# EAGLE design SOLDERING STATION (EAGLE 8.3.0)
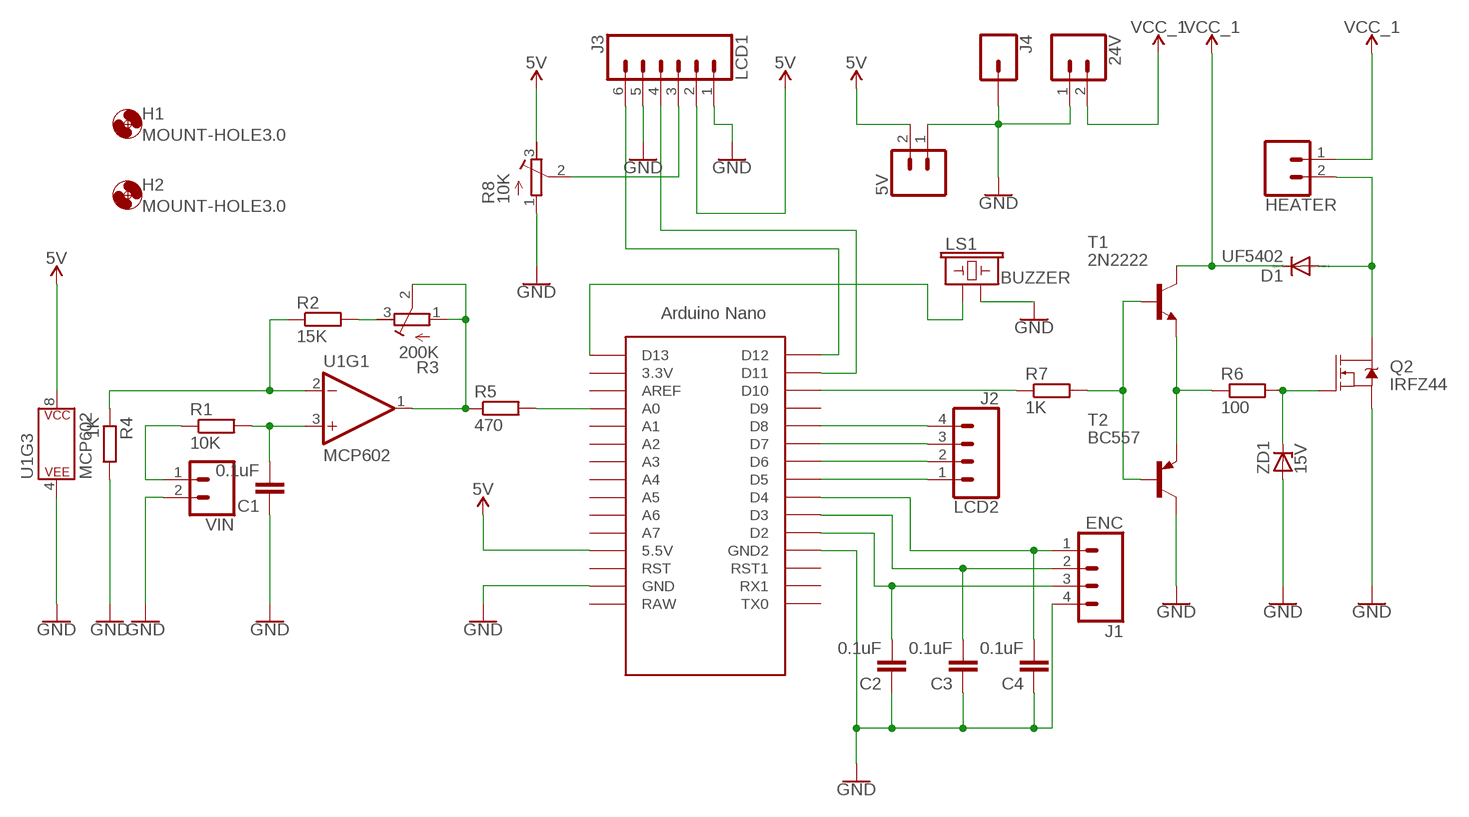
[diagram p0: schematic, sheet 1]

## Parts
5V  CONN_025MM  [SCREWTERMINAL-5MM-2]
24V  CONN_025MM  [SCREWTERMINAL-5MM-2]
C1  0.1uF  C-EU025-024X044  [C025-024X044]
C2  0.1uF  C-EU025-024X044  [C025-024X044]
C3  0.1uF  C-EU025-024X044  [C025-024X044]
C4  0.1uF  C-EU025-024X044  [C025-024X044]
D1  UF5402  UF4003  [DO41-10]
H1  MOUNT-HOLE3.0  [3,0]
H2  MOUNT-HOLE3.0  [3,0]
HEATER  CONN_02PTH4  [1X02_XTRA_BIG]
J1  ENC  CONN_04LONGPADS  [1X04_LONGPADS]
J2  LCD2  CONN_04LONGPADS  [1X04_LONGPADS]
J3  LCD1  CONN_06LONGPADS  [1X06_LONGPADS]
J4  CONN_01PTH_2MM  [1X01_2MM]
LS1  BUZZER  BUZZER-PTH_NO_SILK  [BUZZER-12MM-NS]
Q2  IRFZ44  MOSFET-NCH-FQP30N06L  [TO220V]
R1  10K  R-EU_0204/7  [0204/7]
R2  15K  R-EU_0204/7  [0204/7]
R3  200K  R-TRIMM64W  [RTRIM64W]
R4  1K  R-EU_0204/7  [0204/7]
R5  470  R-EU_0204/7  [0204/7]
R6  100  R-EU_0204/7  [0204/7]
R7  1K  R-EU_0204/7  [0204/7]
R8  10K  R-TRIMM64W  [RTRIM64W]
T1  2N2222  [TO92-EBC-OVAL]
T2  BC557  [TO92]
U1  MCP602  LM358  [DIP08]
U$1  NANO  [NANO]
VIN  CONN_02POLAR_LOCK  [MOLEX-1X2_LOCK]
ZD1  15V  1N4728  [DO41Z10]

## Nets
5V: 5V.2 J3.2 R8.3(E) U1.8(P$V+) U$1.5V(5.5V)
GND: 5V.1 24V.1 C1.1 C2.1 C3.1 C4.1 J1.4 J3.1 J3.5 J4.1 LS1.- Q2.3(S) R4.2 R8.1(A) T2.3(C) U1.4(P$V-) U$1.GND U$1.GND1(GND2) VIN.2 ZD1.A
N$1: C1.2 R1.2 U1.3(+IN)
N$2: R2.1 R4.1 U1.2(-IN)
N$3: R1.1 VIN.1
N$4: R2.2 R3.3(E)
N$5: R3.1(A) R3.2(S) R5.1 U1.1(OUT)
N$6: R5.2 U$1.A0
N$7: R7.1 U$1.D10
N$8: D1.A HEATER.2 Q2.2(D)
N$10: C4.2 J1.1 U$1.D4
N$11: R7.2 T1.B T2.2(B)
N$12: R6.1 T1.E T2.1(E)
N$13: Q2.1(G) R6.2 ZD1.C
N$14: C3.2 J1.2 U$1.D3
N$15: C2.2 J1.3 U$1.D2
N$16: J2.1 U$1.D5
N$17: J2.2 U$1.D6
N$18: J3.3 R8.2(S)
N$19: J2.3 U$1.D7
N$20: J2.4 U$1.D8
N$21: LS1.+ U$1.D13
N$22: J3.6 U$1.D12
N$23: J3.4 U$1.D11
VCC_1: 24V.2 D1.C HEATER.1 T1.C
Unconnected: U1.5(+IN) U1.6(-IN) U1.7(OUT) U$1.3.3V U$1.A1 U$1.A2 U$1.A3 U$1.A4 U$1.A5 U$1.A6 U$1.A7 U$1.AREF U$1.D9 U$1.ICSP1 U$1.ICSP2 U$1.ICSP3 U$1.ICSP4 U$1.ICSP5 U$1.ICSP6 U$1.RAW U$1.RST U$1.RST1 U$1.RX1 U$1.TX0

## Library data of the parts
5V 24V = SparkFun-Connectors:CONN_02: Multi connection point. Often used as Generic Header-pin footprint for 0.1 inch spaced/style header connections On any of the 0.1 inch spaced packages, you can populate with these: Break Away Headers - Straight <https://www.sparkfun.com/products/116> (PRT-00116) Break Away Male Headers - Right Angle <https://www.sparkfun.com/products/553> (PRT-00553) Female Headers <https://www.sparkfun.com/products/115> (PRT-00115) Break Away Headers - Machine Pin <https://www.sparkfun.com/products/117> (PRT-00117) Break Away Female Headers - Swiss Machine Pin <https://www.sparkfun.com/products/743> (PRT-00743) For SCREWTERMINALS and SPRING TERMINALS visit here: Screw Terimnals on SparkFun.com <https://www.sparkfun.com/search/results?term=Screw+Terminals> (5mm/3.5mm/2.54mm spacing) This device is also useful as a general connection point to wire up your design to another part of your project. Our various solder wires solder well into these plated through hole pads. Hook-Up Wire - Assortment (Stranded, 22 AWG) <https://www.sparkfun.com/products/11375> (PRT-11375) Hook-Up Wire - Assortment (Solid Core, 22 AWG) <https://www.sparkfun.com/products/11367> (PRT-11367) View the entire wire category on our website here <https://www.sparkfun.com/categories/141> Special notes: Molex polarized connector foot print use with: PRT-08233 with associated crimp pins and housings. 2.54_SCREWTERM for use with PRT-10571. 3.5mm Screw Terminal footprints for PRT-08084 5mm Screw Terminal footprints for use with PRT-08432; SF_SKU: PRT-08432
C1-C4 = resistor:C-EU: CAPACITOR, European symbol
D1 = diode:UF4003: DIODE ultrafast recovery diode, 200 V rectifier
H1 H2 = holes:MOUNT-HOLE: MOUNTING HOLE with drill center marker
HEATER = SparkFun-Connectors:CONN_02: Multi connection point. Often used as Generic Header-pin footprint for 0.1 inch spaced/style header connections On any of the 0.1 inch spaced packages, you can populate with these: Break Away Headers - Straight <https://www.sparkfun.com/products/116> (PRT-00116) Break Away Male Headers - Right Angle <https://www.sparkfun.com/products/553> (PRT-00553) Female Headers <https://www.sparkfun.com/products/115> (PRT-00115) Break Away Headers - Machine Pin <https://www.sparkfun.com/products/117> (PRT-00117) Break Away Female Headers - Swiss Machine Pin <https://www.sparkfun.com/products/743> (PRT-00743) For SCREWTERMINALS and SPRING TERMINALS visit here: Screw Terimnals on SparkFun.com <https://www.sparkfun.com/search/results?term=Screw+Terminals> (5mm/3.5mm/2.54mm spacing) This device is also useful as a general connection point to wire up your design to another part of your project. Our various solder wires solder well into these plated through hole pads. Hook-Up Wire - Assortment (Stranded, 22 AWG) <https://www.sparkfun.com/products/11375> (PRT-11375) Hook-Up Wire - Assortment (Solid Core, 22 AWG) <https://www.sparkfun.com/products/11367> (PRT-11367) View the entire wire category on our website here <https://www.sparkfun.com/categories/141> Special notes: Molex polarized connector foot print use with: PRT-08233 with associated crimp pins and housings. 2.54_SCREWTERM for use with PRT-10571. 3.5mm Screw Terminal footprints for PRT-08084 5mm Screw Terminal footprints for use with PRT-08432
J1 J2 = SparkFun-Connectors:CONN_04: Multi connection point. Often used as Generic Header-pin footprint for 0.1 inch spaced/style header connections On any of the 0.1 inch spaced packages, you can populate with these: Break Away Headers - Straight <https://www.sparkfun.com/products/116> (PRT-00116) Break Away Male Headers - Right Angle <https://www.sparkfun.com/products/553> (PRT-00553) Female Headers <https://www.sparkfun.com/products/115> (PRT-00115) Break Away Headers - Machine Pin <https://www.sparkfun.com/products/117> (PRT-00117) Break Away Female Headers - Swiss Machine Pin <https://www.sparkfun.com/products/743> (PRT-00743) For SCREWTERMINALS and SPRING TERMINALS visit here: Screw Terimnals on SparkFun.com <https://www.sparkfun.com/search/results?term=Screw+Terminals> (5mm/3.5mm/2.54mm spacing) This device is also useful as a general connection point to wire up your design to another part of your project. Our various solder wires solder well into these plated through hole pads. Hook-Up Wire - Assortment (Stranded, 22 AWG) <https://www.sparkfun.com/products/11375> (PRT-11375) Hook-Up Wire - Assortment (Solid Core, 22 AWG) <https://www.sparkfun.com/products/11367> (PRT-11367) View the entire wire category on our website here <https://www.sparkfun.com/categories/141> Special notes: Molex polarized connector foot print use with SKU : PRT-08231 with associated crimp pins and housings. 1MM SMD Version SKU: PRT-10208; PROD_ID: CONN-09696
J3 = SparkFun-Connectors:CONN_06: Multi connection point. Often used as Generic Header-pin footprint for 0.1 inch spaced/style header connections On any of the 0.1 inch spaced packages, you can populate with these: Break Away Headers - Straight <https://www.sparkfun.com/products/116> (PRT-00116) Break Away Male Headers - Right Angle <https://www.sparkfun.com/products/553> (PRT-00553) Female Headers <https://www.sparkfun.com/products/115> (PRT-00115) Break Away Headers - Machine Pin <https://www.sparkfun.com/products/117> (PRT-00117) Break Away Female Headers - Swiss Machine Pin <https://www.sparkfun.com/products/743> (PRT-00743) Arduino Stackable Header - 6 Pin <https://www.sparkfun.com/products/9280> (PRT-09280) For SCREWTERMINALS and SPRING TERMINALS visit here: Screw Terimnals on SparkFun.com <https://www.sparkfun.com/search/results?term=Screw+Terminals> (5mm/3.5mm/2.54mm spacing) This device is also useful as a general connection point to wire up your design to another part of your project. Our various solder wires solder well into these plated through hole pads. Hook-Up Wire - Assortment (Stranded, 22 AWG) <https://www.sparkfun.com/products/11375> (PRT-11375) Hook-Up Wire - Assortment (Solid Core, 22 AWG) <https://www.sparkfun.com/products/11367> (PRT-11367) View the entire wire category on our website here <https://www.sparkfun.com/categories/141>
J4 = SparkFun-Connectors:CONN_01: Single connection point. Often used as Generic Header-pin footprint for 0.1 inch spaced/style header connections On any of the 0.1 inch spaced packages, you can populate with these: Break Away Headers - Straight <https://www.sparkfun.com/products/116> (PRT-00116) Break Away Male Headers - Right Angle <https://www.sparkfun.com/products/553> (PRT-00553) Female Headers <https://www.sparkfun.com/products/115> (PRT-00115) Break Away Headers - Machine Pin <https://www.sparkfun.com/products/117> (PRT-00117) Break Away Female Headers - Swiss Machine Pin <https://www.sparkfun.com/products/743> (PRT-00743) This device is also useful as a general connection point to wire up your design to another part of your project. Our various solder wires solder well into these plated through hole pads. Hook-Up Wire - Assortment (Stranded, 22 AWG) <https://www.sparkfun.com/products/11375> (PRT-11375) Hook-Up Wire - Assortment (Solid Core, 22 AWG) <https://www.sparkfun.com/products/11367> (PRT-11367) View the entire wire category on our website here <https://www.sparkfun.com/categories/141> Special notes: SMTSO-256-ET is a "flush mount" nut for a 4-40 screw. We mostly use this on specialty testbeds; it is a nice way to connect hardware to your PCB at an adjustable hieght. Also note, the SNAP packages are for using a snappable style connector. We sell a baggie of snaps and they are also used on two LilyPad designs: Snap Assortment - 30 pack (male and female) <https://www.sparkfun.com/products/11347> (DEV-11347) LilyPad Arduino SimpleSnap <https://www.sparkfun.com/products/10941> (DEV-10941) LilyPad SimpleSnap Protoboard <https://www.sparkfun.com/products/10940> (DEV-10940)
LS1 = SparkFun-Electromechanical:BUZZER: Buzzer Small round buzzers that operate around the audible 2kHz range. You can use these as speakers to create simple music or user interfaces. Variant Overview: PTH - Mini Speaker - PC Mount 12mm 2.048kHz <https://www.sparkfun.com/products/7950> PTH_KIT - Mini Speaker - PC Mount 12mm 2.048kHz <https://www.sparkfun.com/products/7950> KIT simplifies soldering by adding stop mask to one side of the pads. PTH_NO_SILK - Mini Speaker - PC Mount 12mm 2.048kHz <https://www.sparkfun.com/products/7950> No silkscreen indicator of buzzer outline. PTH_KIT_NO_SILK - Mini Speaker - PC Mount 12mm 2.048kHz <https://www.sparkfun.com/products/7950> KIT package w/o silkscreen SMD - Buzzer Audio Magnetic (CCV-084B16) SMD buzzer used on, e.g. the LilyPad Buzzer <https://www.sparkfun.com/products/8463> and RFID USB Reader <https://www.sparkfun.com/products/9963>. SMD_KIT - Buzzer Audio Magnetic (CCV-084B16) SMD Buzzer with elongated pins to make soldering easier. Used on the SparkFun Simon Says - Surface Mount Soldering Kit <https://www.sparkfun.com/products/10935>.; PROD_ID: COMP-08253; SF_SKU: COM-07950
Q2 = SparkFun-DiscreteSemi:MOSFET-NCH: N-channel MOSFETs Voltage controlled devices that allow control of high current outputs. SparkFun Products: SparkFun OpenScale <https://www.sparkfun.com/products/13261> SparkFun Digital Sandbox <https://www.sparkfun.com/products/12651> SparkFun Monster Moto Shield <https://www.sparkfun.com/products/10182> SparkFun MOSFET Power Controller <https://www.sparkfun.com/products/11214>; PROD_ID: TRANS-10060; VALUE: 60V/32A/35mΩ
R1 R2 R4-R7 = resistor:R-EU_: RESISTOR, European symbol
R3 R8 = resistor:R-TRIMM: Trimm resistor
T1 = adafruit:2N2222: NPN TRANSISTOR Big oval pads
T2 = transistor-pnp:BC557: PNP Transistor
U1 = SparkFun-IC-Amplifiers:LM358: LM358 Jellybean op-amp Datasheet <http://www.sparkfun.com/datasheets/Components/General/LM358.pdf> SparkFun Products Op-Amp (Thru-Hole) - LM358 <https://www.sparkfun.com/products/9456> (COM-09456); PROD_ID: IC-09172; VALUE: LM358
U$1 = Arduino-clone:NANO: Arduino Nano
VIN = SparkFun-Connectors:CONN_02: Multi connection point. Often used as Generic Header-pin footprint for 0.1 inch spaced/style header connections On any of the 0.1 inch spaced packages, you can populate with these: Break Away Headers - Straight <https://www.sparkfun.com/products/116> (PRT-00116) Break Away Male Headers - Right Angle <https://www.sparkfun.com/products/553> (PRT-00553) Female Headers <https://www.sparkfun.com/products/115> (PRT-00115) Break Away Headers - Machine Pin <https://www.sparkfun.com/products/117> (PRT-00117) Break Away Female Headers - Swiss Machine Pin <https://www.sparkfun.com/products/743> (PRT-00743) For SCREWTERMINALS and SPRING TERMINALS visit here: Screw Terimnals on SparkFun.com <https://www.sparkfun.com/search/results?term=Screw+Terminals> (5mm/3.5mm/2.54mm spacing) This device is also useful as a general connection point to wire up your design to another part of your project. Our various solder wires solder well into these plated through hole pads. Hook-Up Wire - Assortment (Stranded, 22 AWG) <https://www.sparkfun.com/products/11375> (PRT-11375) Hook-Up Wire - Assortment (Solid Core, 22 AWG) <https://www.sparkfun.com/products/11367> (PRT-11367) View the entire wire category on our website here <https://www.sparkfun.com/categories/141> Special notes: Molex polarized connector foot print use with: PRT-08233 with associated crimp pins and housings. 2.54_SCREWTERM for use with PRT-10571. 3.5mm Screw Terminal footprints for PRT-08084 5mm Screw Terminal footprints for use with PRT-08432; SF_ID: PRT-09918
ZD1 = diode:1N4728: Z DIODE 3.3 V, 1W, 5 percent

## Board
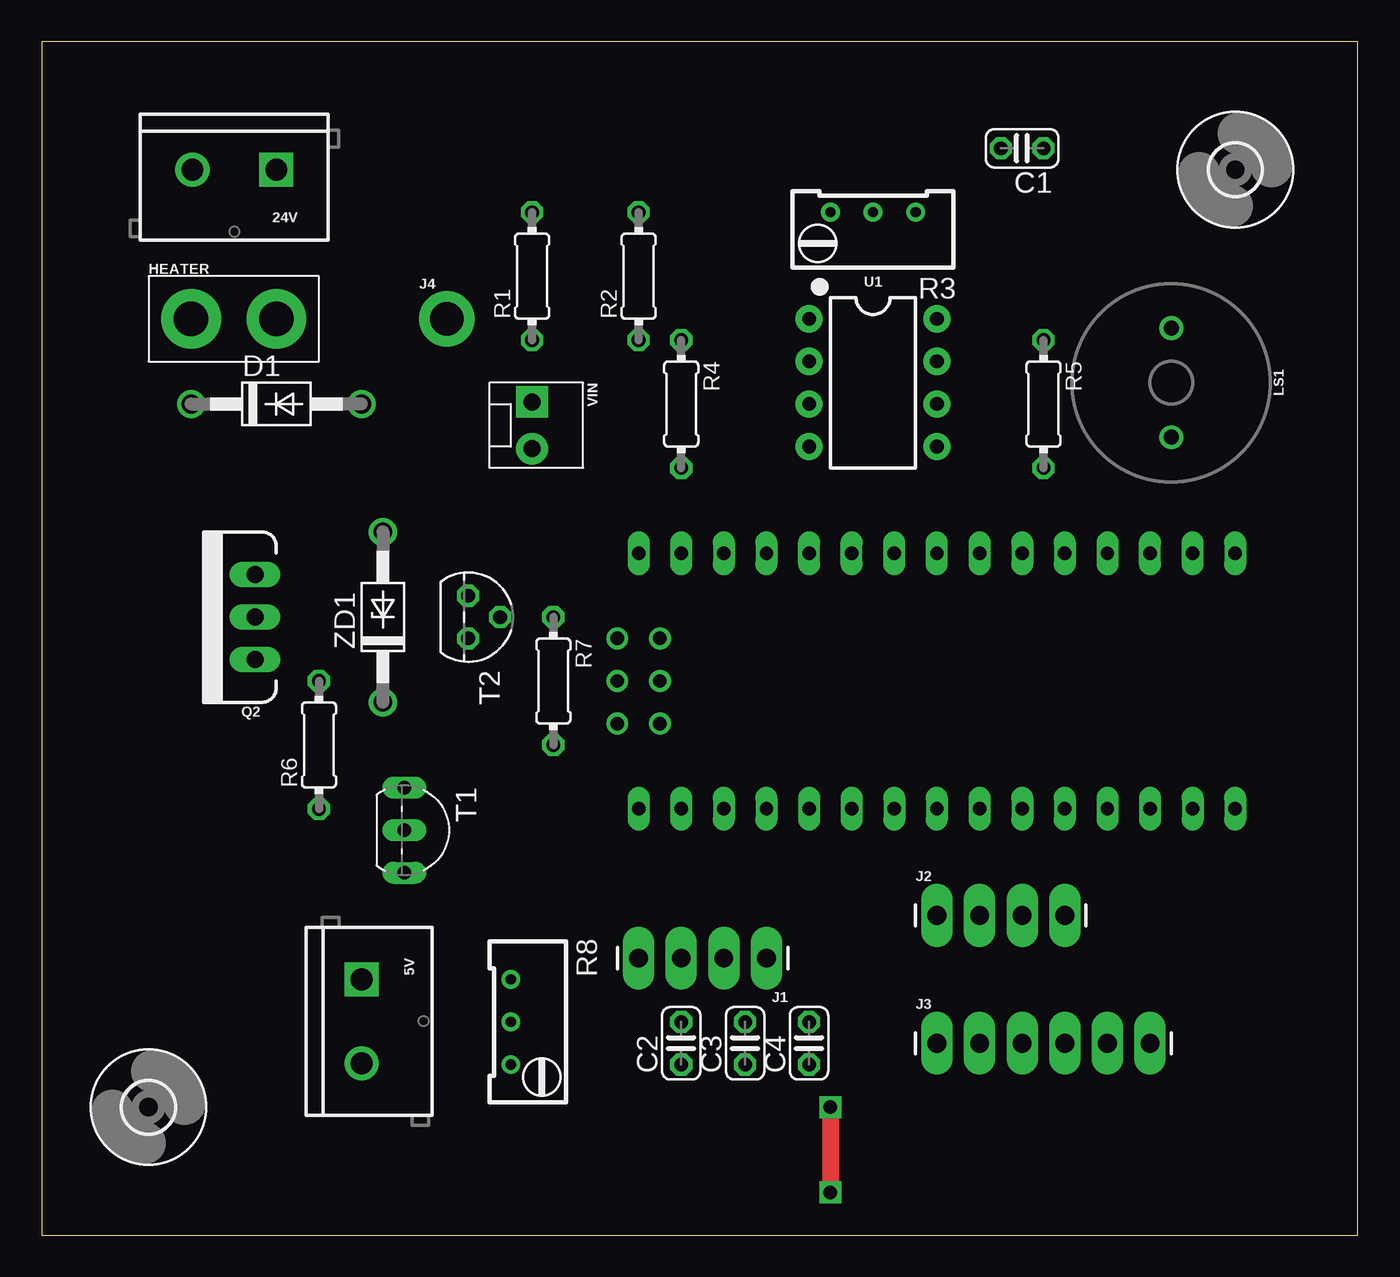
[diagram p1: board, top side]
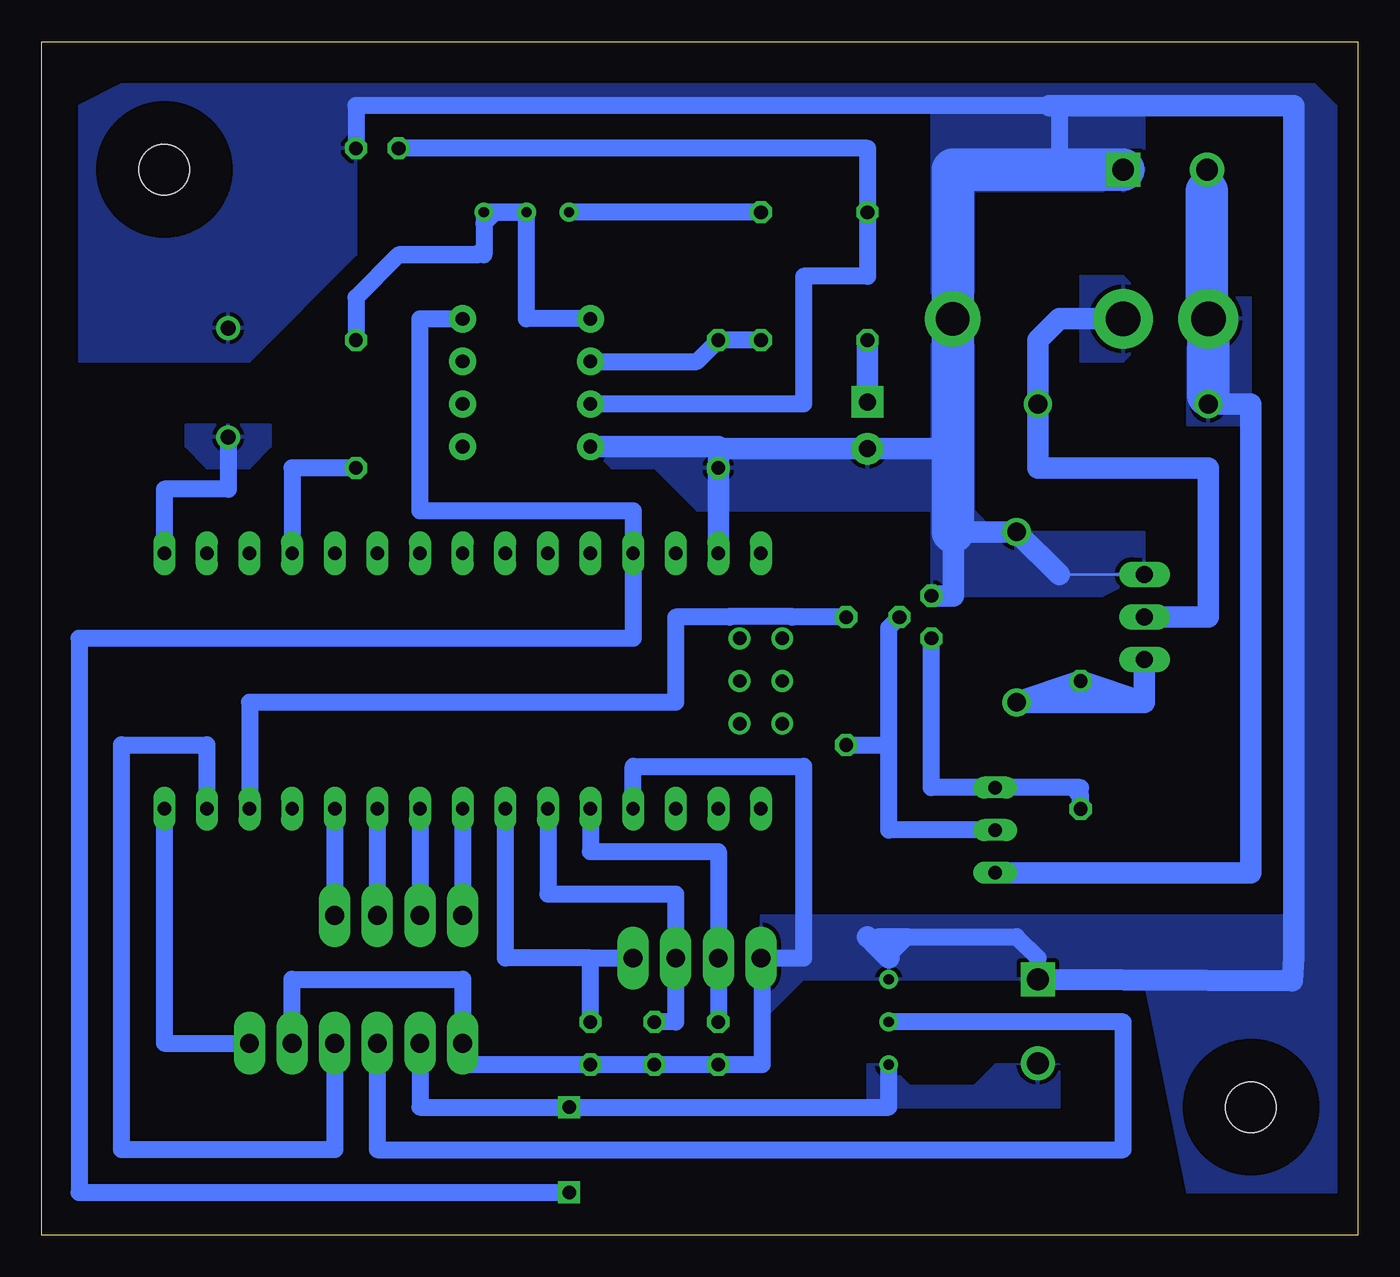
[diagram p2: board, bottom side, seen from below]

Size 78.41 x 71.11 mm. Coordinates in mm from the lower left corner, seen from the top.
Outline: 0,0 78.41,0 78.41,71.11 0,71.11 0,0
Copper layers (1*16): Top 0.035mm / dielectric 1.5mm / Bottom 0.035mm
Design rules "default": minimum track width 6mil, minimum drill 0.35mm, track to track 6mil, track to pad 6mil, pad to pad 6mil, via to via 6mil, smd to smd 6mil, copper to edge 40mil, drill to drill 6mil, minimum pad ring 10mil, minimum via ring 8mil, stop-mask expansion 4mil, vias tented up to drill 0mil, thermal gap 10mil

### Footprints (pad centres in the part's own frame; a part is rotated, then mirrored left to right if it is on the bottom)
SCREWTERMINAL-5MM-2 = drill 1.3 pad 2.032 square: 1 0,0 | drill 1.3 pad 2.032: 2 5,0
C025-024X044 = drill 0.813 octagon: 1 -1.27,0; 2 1.27,0
DO41-10 = drill 1.118: A 5.08,0; C -5.08,0
3,0 = hole 3: 0,0
1X02_XTRA_BIG = drill 2.057 pad 3.556: 1 -2.54,0; 2 2.54,0
1X04_LONGPADS = drill 1.118 pad 1.88 long: 1 0,0; 2 2.54,0; 3 5.08,0; 4 7.62,0
1X06_LONGPADS = drill 1.118 pad 1.88 long: 1 0,0; 2 2.54,0; 3 5.08,0; 4 7.62,0; 5 10.16,0; 6 12.7,0
1X01_2MM = drill 2 pad 3.302: 1 0,0
BUZZER-12MM-NS = drill 0.9: + 3.25,0; - -3.25,0
TO220V = drill 1.016 long: 1 -2.54,0; 2 0,0; 3 2.54,0
0204/7 = drill 0.813 octagon: 1 -3.81,0; 2 3.81,0
RTRIM64W = drill 0.61: 1 1.27,-2.54; 2 1.27,0; 3 1.27,2.54
TO92-EBC-OVAL = drill 0.813 long: B 0,-1.27; C 2.54,-1.27; E -2.54,-1.27
TO92 = drill 0.813 octagon: 1 1.27,0; 2 0,1.905; 3 -1.27,0
DIP08 = drill 0.813 pad 1.626: 1 -3.81,-3.81; 2 -1.27,-3.81; 3 1.27,-3.81; 4 3.81,-3.81; 5 3.81,3.81; 6 1.27,3.81; 7 -1.27,3.81; 8 -3.81,3.81
NANO = drill 0.8 long: 3.3V -10.16,24.13; 5V -10.16,-1.27; A0 -10.16,19.05; A1 -10.16,16.51; A2 -10.16,13.97; A3 -10.16,11.43; A4 -10.16,8.89; A5 -10.16,6.35; A6 -10.16,3.81; A7 -10.16,1.27; AREF -10.16,21.59; D2 5.08,1.27; D3 5.08,3.81; D4 5.08,6.35; D5 5.08,8.89; D6 5.08,11.43; D7 5.08,13.97; D8 5.08,16.51; D9 5.08,19.05; D10 5.08,21.59; D11 5.08,24.13; D12 5.08,26.67; D13 -10.16,26.67; GND -10.16,-6.35; GND1 5.08,-1.27; RAW -10.16,-8.89; RST -10.16,-3.81; RST1 5.08,-3.81; RX1 5.08,-6.35; TX0 5.08,-8.89 | drill 0.8: ICSP1 -5.08,-10.16; ICSP2 -5.08,-7.62; ICSP3 -2.54,-10.16; ICSP4 -2.54,-7.62; ICSP5 0,-10.16; ICSP6 0,-7.62
MOLEX-1X2_LOCK = drill 1.016 pad 1.88 square: 1 -0.127,0 | drill 1.016 pad 1.88: 2 2.667,0
DO41Z10 = drill 1.118: A 5.08,0; C -5.08,0

### Placement (x,y rotation side)
5V  19.05,15.24 270 top
24V  13.97,63.5 180 top
C1  58.42,64.77 180 top
C2  38.1,11.43 90 top
C3  41.91,11.43 90 top
C4  45.72,11.43 90 top
D1  13.97,49.53 0 top
H1  6.35,7.62 0 top
H2  71.12,63.5 0 top
HEATER  11.43,54.61 0 top
J1  43.18,16.51 180 top
J2  53.34,19.05 0 top
J3  53.34,11.43 0 top
J4  24.13,54.61 0 top
LS1  67.31,50.8 270 top
Q2  12.7,36.83 90 top
R1  29.21,57.15 90 top
R2  35.56,57.15 90 top
R3  49.53,59.69 90 top
R4  38.1,49.53 270 top
R5  59.69,49.53 270 top
R6  16.51,29.21 90 top
R7  30.48,33.02 270 top
R8  29.21,12.7 180 top
T1  22.86,24.13 270 top
T2  25.4,36.83 270 top
U1  49.53,50.8 270 top
U$1  44.45,30.48 270 top
VIN  29.21,49.53 270 top
ZD1  20.32,36.83 90 top

### Tracks (layer width: path | path; a pad name or v marks a point on that pad's centre or on a via)
5V  (via drill 0.8 pad 1.3)
  Top 1.016: v46.99,7.62 v46.99,2.54
  Bottom 1.016: J3.2 55.88,7.62 v46.99,7.62 27.94,7.62 R8.3 | v46.99,2.54 76.2,2.54 76.2,35.56 43.18,35.56 U$1.5V 43.18,43.18 55.88,43.18 55.88,54.61 U1.8
  pour Bottom: 19.05,10.16 21.59,10.16 22.86,8.89 26.67,8.89 27.94,10.16 29.21,10.16 29.21,7.62 19.05,7.62 17.78,7.62 17.78,10.16
GND  (via drill 0.35)
  Bottom 0.152: Q2.3 17.78,39.37
  Bottom 0.2: J4.1 24.13,54.65
  Bottom 0.813: 24V.1 17.78,63.5 17.78,66.04
  Bottom 1.016: 18.12,63.5 17.78,63.84 17.78,67.31 18.35,67.31 59.69,67.31 C1.1 | 5V.1 19.05,16.51 20.32,17.78 26.85,17.78 | 26.85,17.78 28.51,17.78 28.86,17.43 | 27.94,16.69 26.85,17.78 | J3.5 63.5,15.24 53.34,15.24 J3.1 53.34,10.16 C4.1 C3.1 C2.1 35.47,10.16 35.47,16.51 | U$1.GND1 43.18,27.94 33.02,27.94 33.02,16.51 35.47,16.51 | 35.47,16.51 J1.4
  Bottom 1.27: U$1.GND R4.2 38.1,46.99 | 38.1,46.99 U1.4 | 24.08,41.91 ZD1.A 17.78,39.37 | 24.13,41.91 24.08,41.91 | T2.3 24.08,38.1 24.08,41.91 | 5V.1 3.89,15.16 3.81,16.51 3.81,67.31 18.35,67.31 | 38.1,46.99 37.97,46.86 VIN.2 24.13,46.86 24.13,45.72 | 27.94,16.51 28.86,17.43 29.21,17.78
  Bottom 2.54: 24V.1 18.12,63.5 24.13,63.5 24.13,54.65 24.13,45.72 24.13,41.91
  other vias: 43.18,25.4
  pour Bottom: 62.23,63.5 59.69,64.77 59.69,67.31 25.4,67.31 25.4,39.37 24.13,38.1 15.24,38.1 12.7,39.37 12.7,41.91 21.59,41.91 22.86,43.18 22.86,62.23 12.7,62.23 12.7,67.31 3.81,67.31 3.81,19.05 35.56,19.05 35.56,12.7 33.02,15.24 12.7,15.24 10.16,2.54 1.27,2.54 1.27,67.31 2.54,68.58 62.23,68.58
  pour Bottom: 59.69,68.58 59.69,58.42 66.04,52.07 76.2,52.07 76.2,67.31 73.66,68.58
  pour Bottom: 45.72,46.99 24.13,46.99 24.13,38.1 25.4,38.1 25.4,43.18 39.37,43.18 41.91,45.72 44.45,45.72
N$1
  Bottom 1.016: C1.2 29.21,64.77 R1.2 29.21,57.15 33.02,57.15 33.02,49.53 U1.3
N$2
  Bottom 1.016: U1.2 39.37,52.07 R4.1 R2.1
N$3
  Bottom 1.27: R1.1 VIN.1
N$4
  Bottom 1.016: R2.2 R3.3
N$5
  Bottom 0.813: R3.1 52.07,60.3 52.07,58.42 52.46,58.42
  Bottom 1.016: R3.2 51.41,60.96 52.07,60.3 | R3.1 52.07,58.82 52.46,58.42 | 57.15,58.42 59.69,55.88 R5.1 | U1.1 49.53,54.61 R3.2 | R3.2 R3.1 | R3.1 52.07,58.42 52.46,58.42 | 52.46,58.42 57.15,58.42 | 57.15,58.42 52.46,58.42
N$6
  Bottom 1.016: R5.2 63.5,45.72 U$1.A0
N$7
  Bottom 1.016: R7.1 33.7,36.83 33.75,36.87 37.37,36.87 37.42,36.83 40.64,36.83 40.64,31.75 66.04,31.75 U$1.D10
N$8
  Bottom 1.27: HEATER.2 17.78,54.61 19.05,53.34 D1.A 19.05,45.72 8.89,45.72 8.89,36.83 Q2.2
  pour Bottom: 12.7,54.61 12.7,55.88 13.97,57.15 16.51,57.15 16.51,52.07 13.97,52.07 12.7,53.34
N$10
  Bottom 1.016: U$1.D4 50.8,16.51 45.72,16.51 | 45.72,16.51 J1.1 | C4.2 45.72,16.51
N$11
  Bottom 1.016: T1.B 27.94,24.13 27.94,29.21 | 27.94,29.21 27.94,36.2 T2.2 | R7.2 27.94,29.21
N$12
  Bottom 1.016: 17.01,26.67 16.51,26.17 R6.1 16.51,26.67 T1.E 25.4,26.67 T2.1
N$13
  Bottom 1.27: 12.7,31.75 Q2.1 | 12.7,31.75 ZD1.C R6.2 12.7,31.75
N$14
  Bottom 1.016: U$1.D3 48.26,20.32 40.64,20.32 J1.2 40.64,12.7 C3.2
N$15
  Bottom 1.016: U$1.D2 45.72,22.86 38.1,22.86 J1.3 C2.2
N$16
  Bottom 1.016: U$1.D5 J2.1
N$17
  Bottom 1.016: U$1.D6 J2.2
N$18
  Bottom 1.016: J3.3 58.42,5.08 13.97,5.08 13.97,12.7 R8.2
N$19
  Bottom 1.016: U$1.D7 J2.3
N$20
  Bottom 1.016: U$1.D8 J2.4
N$21
  Bottom 1.016: LS1.+ 67.31,44.45 71.12,44.45 U$1.D13
  pour Bottom: 64.77,48.26 69.85,48.26 69.85,46.99 68.58,45.72 66.04,45.72 64.77,46.99
N$22
  Bottom 1.016: U$1.D12 71.12,11.43 J3.6
N$23
  Bottom 1.016: J3.4 60.96,5.08 73.66,5.08 73.66,29.21 68.58,29.21 U$1.D11
VCC_1
  Bottom 0.152: 8.97,62.23 24V.2
  Bottom 1.27: 8.89,50.02 D1.C 6.35,49.53 6.35,21.59 T1.C
  Bottom 2.54: 8.97,62.23 8.97,54.61 HEATER.1 8.89,50.02
  pour Bottom: 6.35,49.53 6.35,55.88 10.16,55.88 10.16,48.26 6.35,48.26